# EAGLE design memory card (EAGLE 9.6.0)
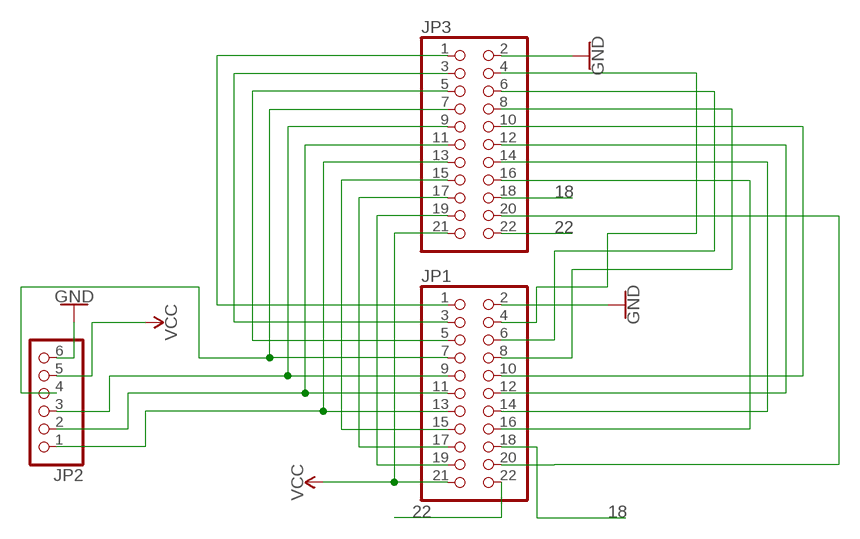
[diagram p0: schematic, sheet 1]

## Parts
JP1  PINHD-2X11/90  [2X11/90]
JP2  PINHD-1X6  [1X06]
JP3  PINHD-2X11/90  [2X11/90]

## Nets
18: JP1.18 JP3.18
22: JP1.22 JP3.22
GND: JP1.2 JP2.6 JP3.2
N$1: JP1.20 JP3.20
N$4: JP1.16 JP3.16
N$5: JP1.14 JP3.14
N$6: JP1.8 JP3.8
N$7: JP1.19 JP3.19
N$8: JP1.17 JP3.17
N$9: JP1.15 JP3.15
N$10: JP1.13 JP2.1 JP3.13
N$11: JP1.11 JP2.2 JP3.11
N$12: JP1.9 JP2.3 JP3.9
N$13: JP1.7 JP2.4 JP3.7
N$14: JP1.5 JP3.5
N$15: JP1.3 JP3.3
N$16: JP1.1 JP3.1
N$17: JP1.6 JP3.6
N$18: JP1.4 JP3.4
N$19: JP1.12 JP3.12
N$20: JP1.10 JP3.10
VCC: JP1.21 JP2.5 JP3.21

## Library data of the parts
JP1 JP3 = pinhead:PINHD-2X11: PIN HEADER
JP2 = adafruit:PINHD-1X6: PIN HEADER

## Board
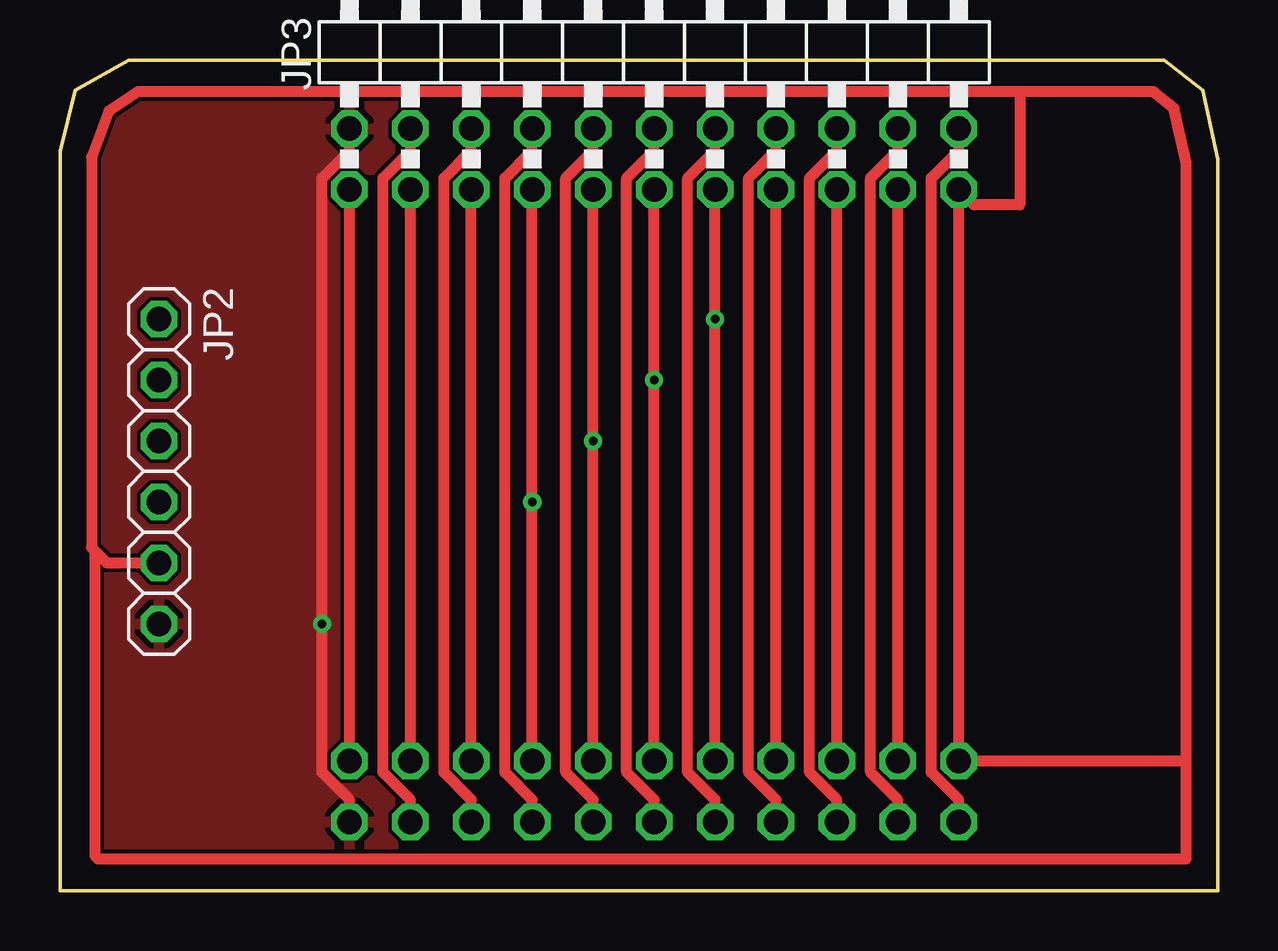
[diagram p1: board, top side]
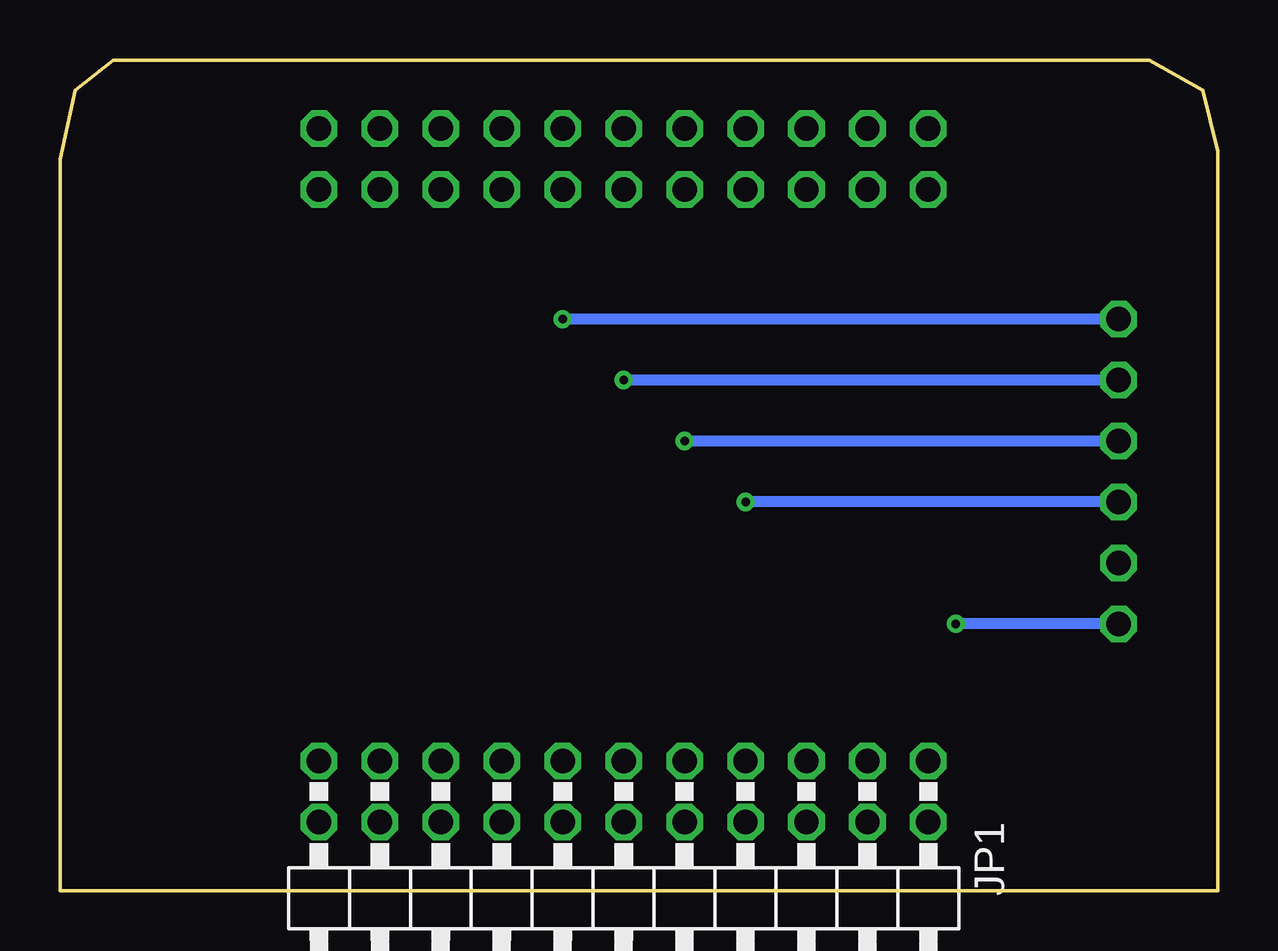
[diagram p2: board, bottom side, seen from below]

Size 48.26 x 34.61 mm. Coordinates in mm from the lower left corner, seen from the top.
Outline: 0.63,33.34 2.86,34.61 46.04,34.61 47.62,33.34 48.26,30.48 48.26,0 0,0 0,30.8 0.63,33.34
Copper layers (1*16): Top 0.035mm / dielectric 1.5mm / Bottom 0.035mm
Design rules "default": minimum track width 6mil, minimum drill 0.35mm, track to track 6mil, track to pad 6mil, pad to pad 6mil, via to via 6mil, smd to smd 6mil, copper to edge 40mil, drill to drill 6mil, minimum pad ring 10mil, minimum via ring 8mil, stop-mask expansion 4mil, vias tented up to drill 0mil, thermal gap 10mil

### Footprints (pad centres in the part's own frame; a part is rotated, then mirrored left to right if it is on the bottom)
2X11/90 = drill 1.016 octagon: 1 -12.7,-6.35; 2 -12.7,-3.81; 3 -10.16,-6.35; 4 -10.16,-3.81; 5 -7.62,-6.35; 6 -7.62,-3.81; 7 -5.08,-6.35; 8 -5.08,-3.81; 9 -2.54,-6.35; 10 -2.54,-3.81; 11 0,-6.35; 12 0,-3.81; 13 2.54,-6.35; 14 2.54,-3.81; 15 5.08,-6.35; 16 5.08,-3.81; 17 7.62,-6.35; 18 7.62,-3.81; 19 10.16,-6.35; 20 10.16,-3.81; 21 12.7,-6.35; 22 12.7,-3.81
1X06 = drill 1.016 octagon: 1 -6.35,0; 2 -3.81,0; 3 -1.27,0; 4 1.27,0; 5 3.81,0; 6 6.35,0

### Placement (x,y rotation side)
JP1  24.77,-0.95 180 bottom
JP2  4.13,17.46 270 top
JP3  24.77,35.56 0 top

### Tracks (layer width: path | path; a pad name or v marks a point on that pad's centre or on a via)
18
  Top 0.457: JP1.18 32.38,3.78 31.24,4.92 31.24,29.68 32.38,30.83 JP3.18
22
  Top 0.457: JP1.22 37.46,3.78 36.32,4.92 36.32,29.68 37.46,30.83 JP3.22
GND  (via drill 0.35)
  Top 0.457: JP1.2 12.06,3.78 10.92,4.92 v10.92,11.11 10.92,29.68 12.06,30.83 JP3.2
  Bottom 0.457: JP2.6 v10.92,11.11
  pour Top: -2.22,34.92 -2.22,-1.27 49.21,-1.27 49.21,34.92
N$1
  Top 0.457: JP1.20 34.92,3.78 33.78,4.92 33.78,29.68 34.92,30.83 JP3.20
N$4
  Top 0.457: JP1.16 29.84,3.78 28.7,4.92 28.7,29.68 29.84,30.83 JP3.16
N$5
  Top 0.457: JP1.14 27.3,3.78 26.16,4.92 26.16,29.68 27.3,30.83 JP3.14
N$6
  Top 0.457: JP1.8 19.69,3.78 18.54,4.92 18.54,29.68 19.69,30.83 JP3.8
N$7
  Top 0.457: JP1.19 JP3.19
N$8
  Top 0.457: JP1.17 JP3.17
N$9
  Top 0.457: JP1.15 JP3.15
N$10  (via drill 0.35)
  Top 0.457: JP1.13 v27.3,23.81 JP3.13
  Bottom 0.457: JP2.1 v27.3,23.81
N$11  (via drill 0.35)
  Top 0.457: JP1.11 v24.77,21.27 JP3.11
  Bottom 0.457: JP2.2 v24.77,21.27
N$12  (via drill 0.35)
  Top 0.457: JP1.9 v22.23,18.73 JP3.9
  Bottom 0.457: JP2.3 v22.23,18.73
N$13  (via drill 0.35)
  Top 0.457: JP1.7 v19.69,16.19 JP3.7
  Bottom 0.457: JP2.4 v19.69,16.19
N$14
  Top 0.457: JP1.5 JP3.5
N$15
  Top 0.457: JP1.3 JP3.3
N$16
  Top 0.457: JP1.1 JP3.1
N$17
  Top 0.457: JP1.6 17.14,3.78 16,4.92 16,29.68 17.14,30.83 JP3.6
N$18
  Top 0.457: JP1.4 14.61,3.78 13.46,4.92 13.46,29.68 14.61,30.83 JP3.4
N$19
  Top 0.457: JP1.12 24.77,3.78 23.62,4.92 23.62,29.68 24.77,30.83 JP3.12
N$20
  Top 0.457: JP1.10 22.23,3.78 21.08,4.92 21.08,29.68 22.23,30.83 JP3.10
VCC
  Top 0.457: 46.94,6.03 46.94,5.4 JP1.21 JP3.21 38.1,28.57 40.01,28.57 40.01,33.29 | 46.94,6.03 46.94,30.33 46.44,32.6 46.23,32.76 | 46.23,32.76 | 46.23,32.76 45.57,33.29 40.01,33.29 | 1.45,14.15 1.32,14.29 1.32,30.56 2.04,32.48 3.26,33.29 40.01,33.29 | 1.45,14.15 1.96,13.65 JP2.5 | 1.45,14.15 1.45,1.45 1.59,1.32 46.94,1.32 46.94,6.03